# Altium project LED.PrjPCB
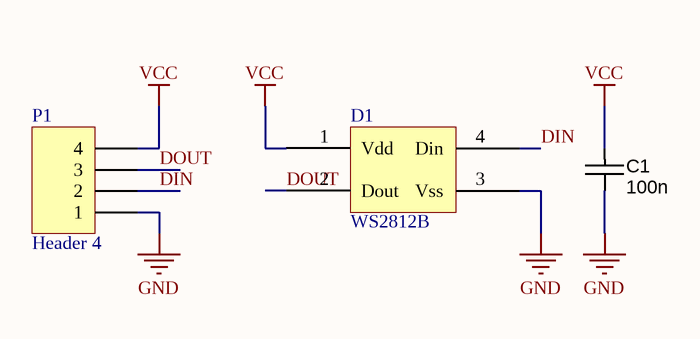
[diagram p0: Led.SchDoc]
1 sheet, 3 parts. Net scope: global (net labels, ports and power ports of the same name join across sheets).
Board file: Led.PcbDoc

## Sheet Led.SchDoc
size A4

### Parts
C1  value 100n  [CAPC2012X135N]  (hidden comment: approved sub OK)
D1  WS2812B  [5050LED]
P1  Header 4  [HDR1X4]

### Nets
GND: C1.2 D1.3(Vss) P1.1
VCC: C1.1 D1.1(Vdd) P1.4
DIN: D1.4(Din) P1.2
DOUT: D1.2(Dout) P1.3

### Library data of the parts
C1 = CAPC_100n_0805_X7R_50V_10%: Capacitor SMD Cer 100nF 10% 50V X7R 0805; Manufacturer 1: Kemet; Manufacturer Part Number 1: C0805C104K5RACTU; Ratings: 50V; X7R; Material: ceramic; SCDType: undef; Package / Case: 0805 (2012 metric); Tolerance: ±10%; Supplier 1: Digi-Key; Supplier Part Number 1: 399-1170-1-ND
D1 = WS2812B: WS2812B RGB LED
P1 = Header 4: Header, 4-Pin; LatestRevisionDate: 17-Jul-2002; LatestRevisionNote: Re-released for DXP Platform.; Publisher: Altium Limited